# EAGLE board toyotune_3s (EAGLE 7.7.0)
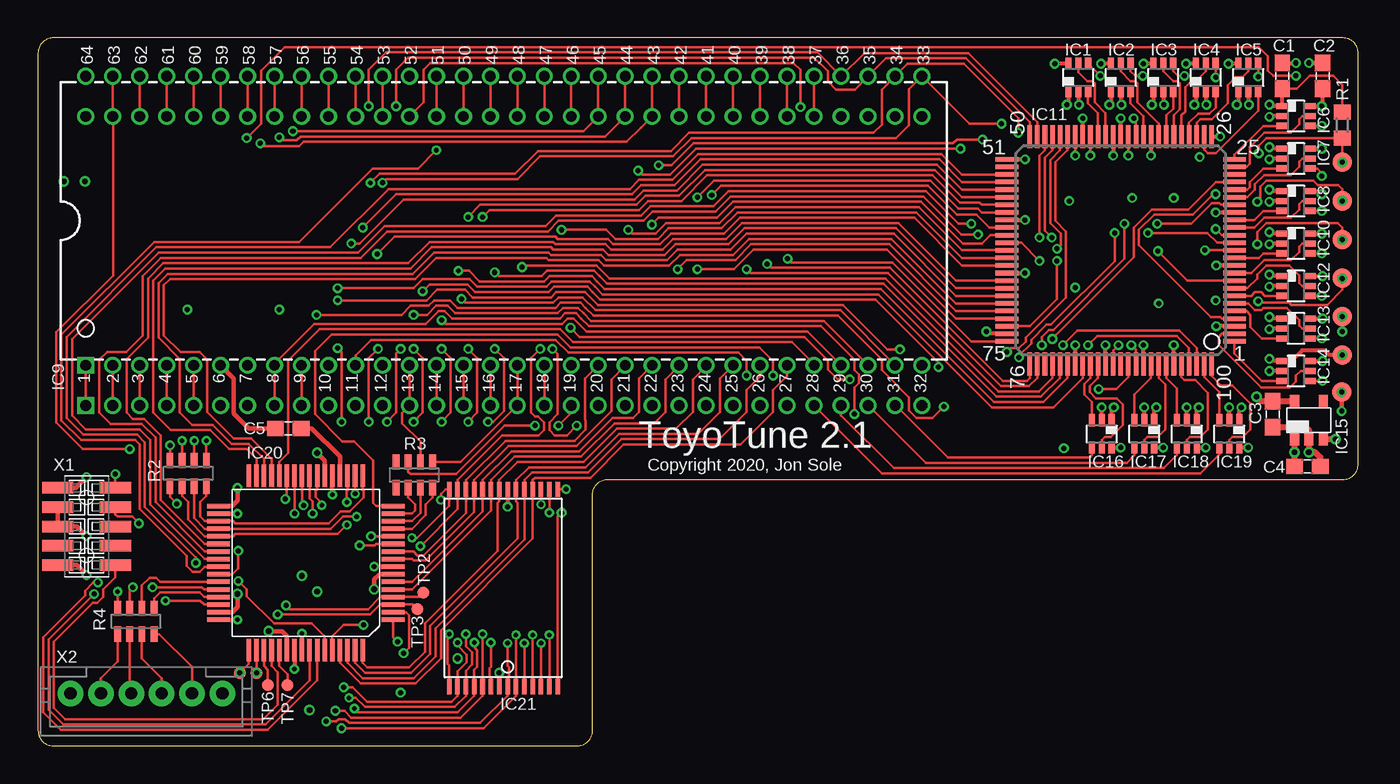
[diagram p5: board, top side]
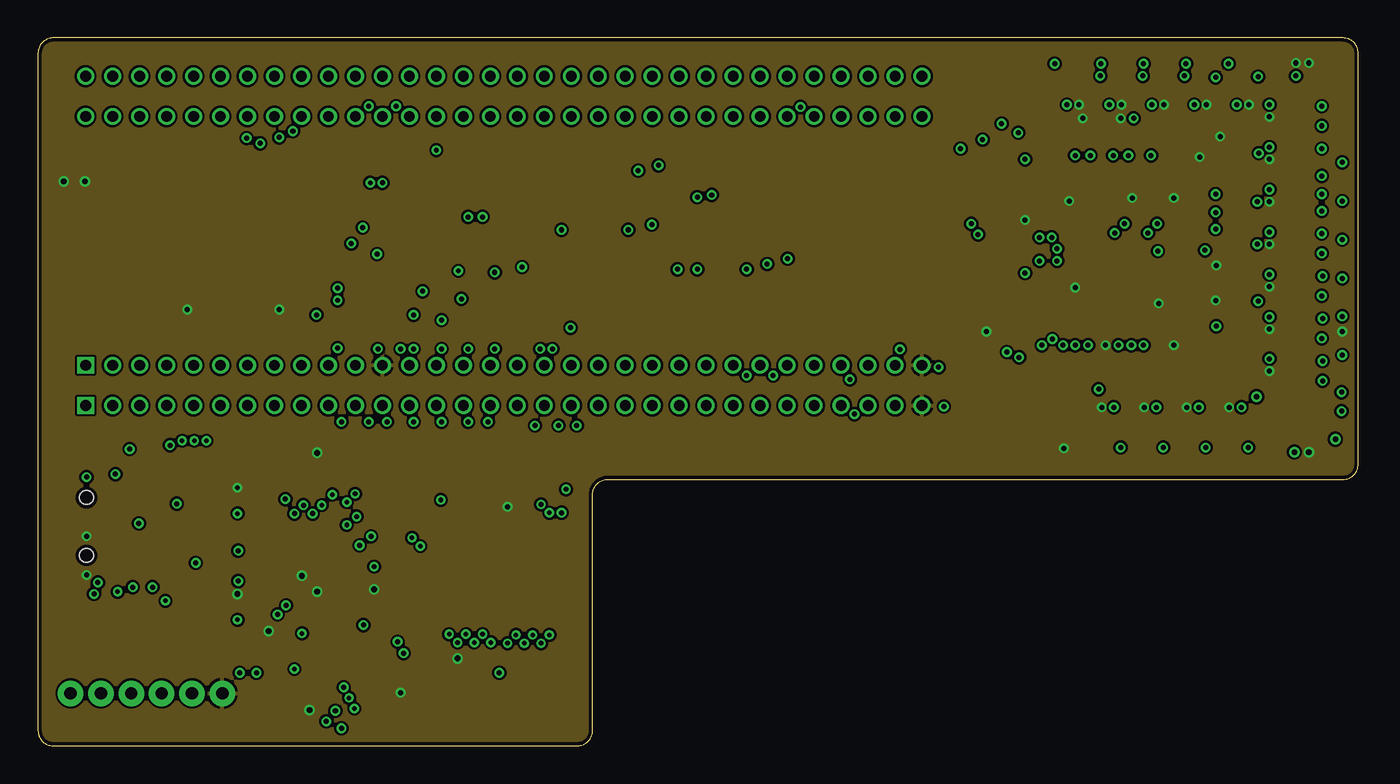
[diagram p6: board, inner layer GND]
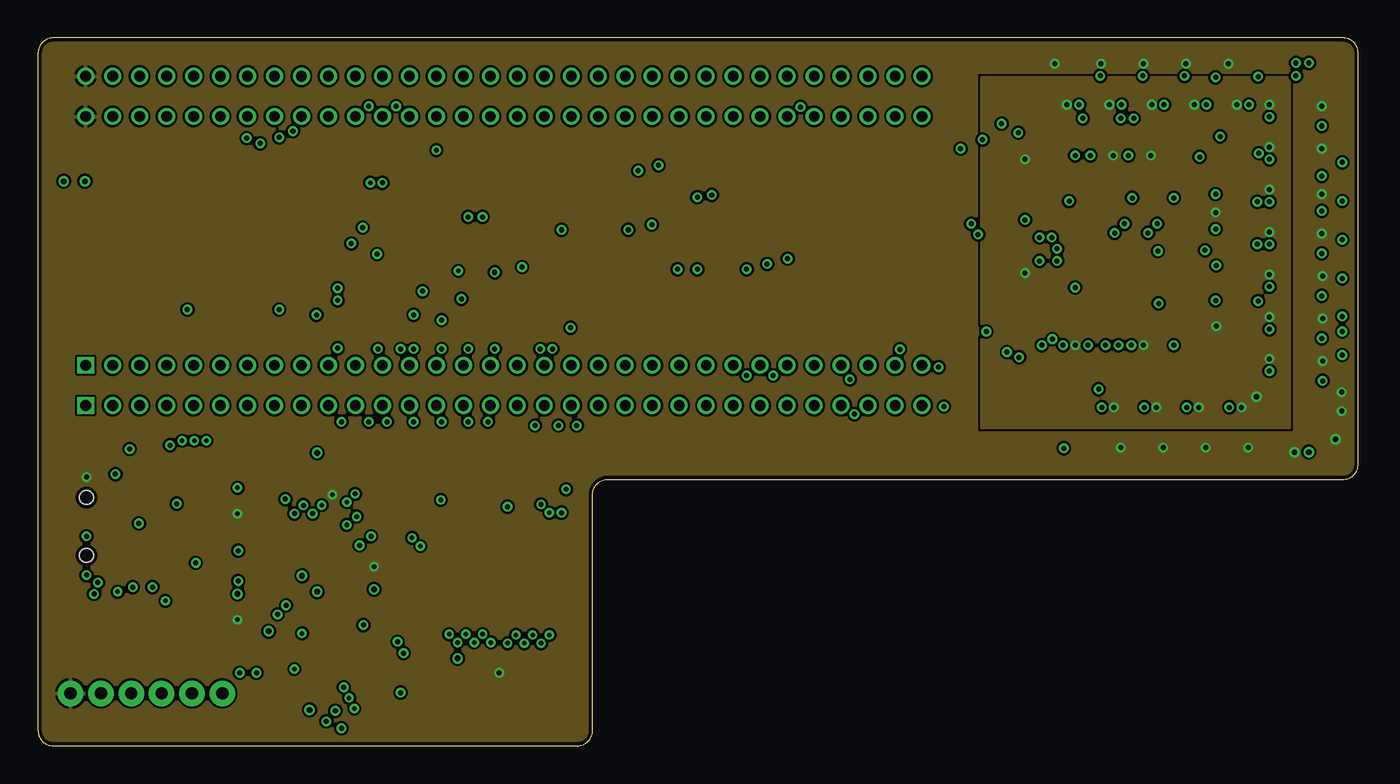
[diagram p7: board, inner layer Supply]
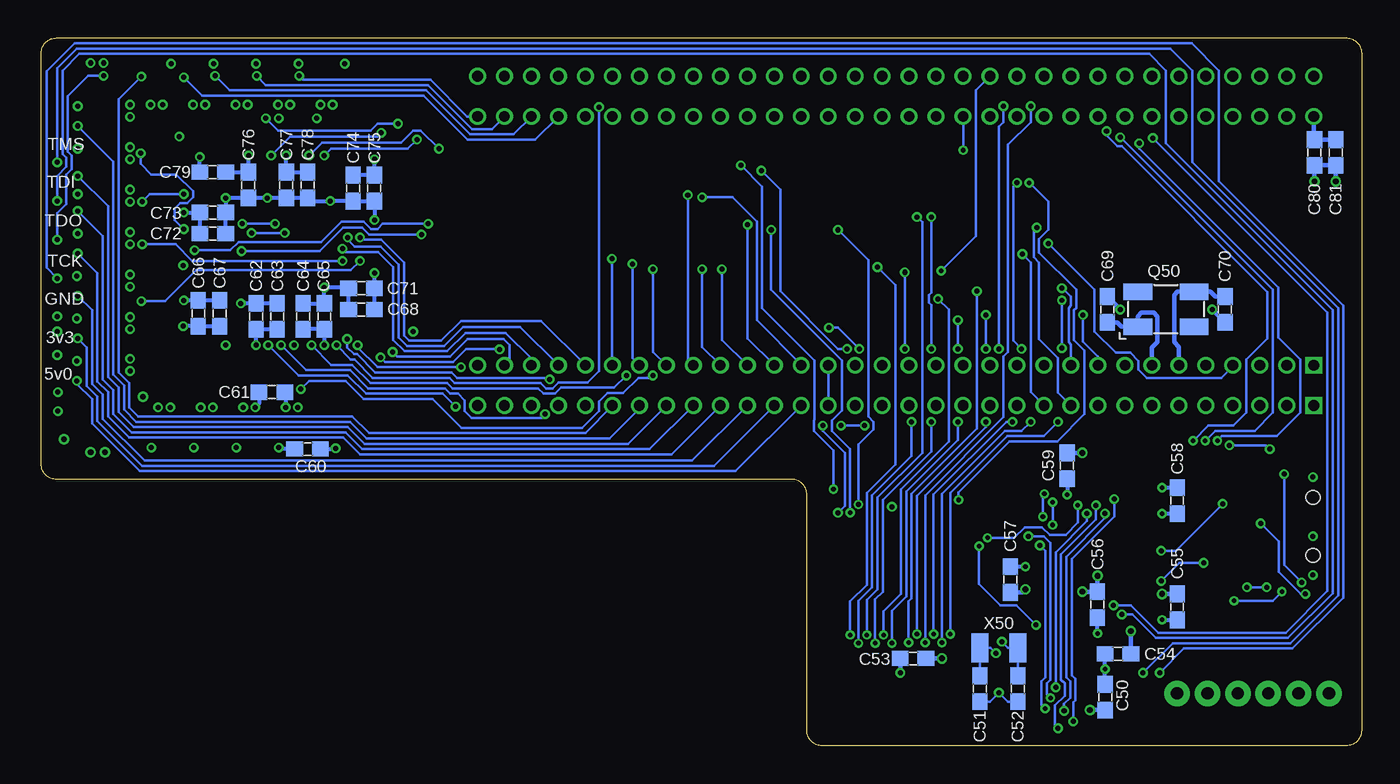
[diagram p8: board, bottom side, seen from below]

Size 87 x 46.65 mm. Coordinates in mm from the lower left corner, seen from the top.
Outline: 1.05,46.65 arc90 0,45.65 0,1 arc90 1,0 35.55,0 arc90 36.55,1 36.55,16.55 arc-90 37.55,17.55 86,17.55 arc90 87,18.55 87,45.65 arc90 86,46.65 1.05,46.65
Copper layers (1*2+15*16): Top 0.035mm / dielectric 1.5mm / GND 0.035mm / dielectric 0.15mm / Supply 0.035mm / dielectric 0.2mm / Bottom 0.035mm
Design rules "pcbway-4layer *": minimum track width 6mil, minimum drill 12mil, track to track 6mil, track to pad 6mil, pad to pad 6mil, via to via 6mil, smd to smd 0mil, copper to edge 10mil, drill to drill 10mil, minimum pad ring 8mil, minimum via ring 6mil, stop-mask expansion 2mil, vias tented up to drill 100mil, thermal gap 7mil

## Footprints (pad centres in the part's own frame; a part is rotated, then mirrored left to right if it is on the bottom)
C0603 = smd 1.1 x 1: 1 -0.85,0; 2 0.85,0
DCK_R-PDSO-G6 = smd 0.4 x 0.8: 1 -0.65,-0.9; 2 0,-0.9; 3 0.65,-0.9; 4 0.65,0.9; 5 0,0.9; 6 -0.65,0.9
SDIP-64 = drill 0.711 square: 1 -27.559,-9.525 | drill 0.711: 2 -25.781,-9.525; 3 -24.003,-9.525; 4 -22.225,-9.525; 5 -20.447,-9.525; 6 -18.669,-9.525; 7 -16.891,-9.525; 8 -15.113,-9.525; 9 -13.335,-9.525; 10 -11.557,-9.525; 11 -9.779,-9.525; 12 -8.001,-9.525; 13 -6.223,-9.525; 14 -4.445,-9.525; 15 -2.667,-9.525; 16 -0.889,-9.525; 17 0.889,-9.525; 18 2.667,-9.525; 19 4.445,-9.525; 20 6.223,-9.525; 21 8.001,-9.525; 22 9.779,-9.525; 23 11.557,-9.525; 24 13.335,-9.525; 25 15.113,-9.525; 26 16.891,-9.525; 27 18.669,-9.525; 28 20.447,-9.525; 29 22.225,-9.525; 30 24.003,-9.525; 31 25.781,-9.525; 32 27.559,-9.525; 33 27.559,9.525; 34 25.781,9.525; 35 24.003,9.525; 36 22.225,9.525; 37 20.447,9.525; 38 18.669,9.525; 39 16.891,9.525; 40 15.113,9.525; 41 13.335,9.525; 42 11.557,9.525; 43 9.779,9.525; 44 8.001,9.525; 45 6.223,9.525; 46 4.445,9.525; 47 2.667,9.525; 48 0.889,9.525; 49 -0.889,9.525; 50 -2.667,9.525; 51 -4.445,9.525; 52 -6.223,9.525; 53 -8.001,9.525; 54 -9.779,9.525; 55 -11.557,9.525; 56 -13.335,9.525; 57 -15.113,9.525; 58 -16.891,9.525; 59 -18.669,9.525; 60 -20.447,9.525; 61 -22.225,9.525; 62 -24.003,9.525; 63 -25.781,9.525; 64 -27.559,9.525
VQ100 = smd 1.5 x 0.3: 1 -7.5,6; 2 -7.5,5.5; 3 -7.5,5; 4 -7.5,4.5; 5 -7.5,4; 6 -7.5,3.5; 7 -7.5,3; 8 -7.5,2.5; 9 -7.5,2; 10 -7.5,1.5; 11 -7.5,1; 12 -7.5,0.5; 13 -7.5,0; 14 -7.5,-0.5; 15 -7.5,-1; 16 -7.5,-1.5; 17 -7.5,-2; 18 -7.5,-2.5; 19 -7.5,-3; 20 -7.5,-3.5; 21 -7.5,-4; 22 -7.5,-4.5; 23 -7.5,-5; 24 -7.5,-5.5; 25 -7.5,-6; 51 7.5,-6; 52 7.5,-5.5; 53 7.5,-5; 54 7.5,-4.5; 55 7.5,-4; 56 7.5,-3.5; 57 7.5,-3; 58 7.5,-2.5; 59 7.5,-2; 60 7.5,-1.5; 61 7.5,-1; 62 7.5,-0.5; 63 7.5,0; 64 7.5,0.5; 65 7.5,1; 66 7.5,1.5; 67 7.5,2; 68 7.5,2.5; 69 7.5,3; 70 7.5,3.5; 71 7.5,4; 72 7.5,4.5; 73 7.5,5; 74 7.5,5.5; 75 7.5,6 | smd 0.3 x 1.5: 26 -6,-7.5; 27 -5.5,-7.5; 28 -5,-7.5; 29 -4.5,-7.5; 30 -4,-7.5; 31 -3.5,-7.5; 32 -3,-7.5; 33 -2.5,-7.5; 34 -2,-7.5; 35 -1.5,-7.5; 36 -1,-7.5; 37 -0.5,-7.5; 38 0,-7.5; 39 0.5,-7.5; 40 1,-7.5; 41 1.5,-7.5; 42 2,-7.5; 43 2.5,-7.5; 44 3,-7.5; 45 3.5,-7.5; 46 4,-7.5; 47 4.5,-7.5; 48 5,-7.5; 49 5.5,-7.5; 50 6,-7.5; 76 6,7.5; 77 5.5,7.5; 78 5,7.5; 79 4.5,7.5; 80 4,7.5; 81 3.5,7.5; 82 3,7.5; 83 2.5,7.5; 84 2,7.5; 85 1.5,7.5; 86 1,7.5; 87 0.5,7.5; 88 0,7.5; 89 -0.5,7.5; 90 -1,7.5; 91 -1.5,7.5; 92 -2,7.5; 93 -2.5,7.5; 94 -3,7.5; 95 -3.5,7.5; 96 -4,7.5; 97 -4.5,7.5; 98 -5,7.5; 99 -5.5,7.5; 100 -6,7.5
DDC_R-PDSO-G5 = smd 0.6 x 0.8: 1 -0.95,-1.25; 2 0,-1.25; 3 0.95,-1.25; 4 0.95,1.25; 5 -0.95,1.25
TQFP64-05 = smd 1.5 x 0.3: 1 -5.75,3.75; 2 -5.75,3.25; 3 -5.75,2.75; 4 -5.75,2.25; 5 -5.75,1.75; 6 -5.75,1.25; 7 -5.75,0.75; 8 -5.75,0.25; 9 -5.75,-0.25; 10 -5.75,-0.75; 11 -5.75,-1.25; 12 -5.75,-1.75; 13 -5.75,-2.25; 14 -5.75,-2.75; 15 -5.75,-3.25; 16 -5.75,-3.75; 33 5.75,-3.75; 34 5.75,-3.25; 35 5.75,-2.75; 36 5.75,-2.25; 37 5.75,-1.75; 38 5.75,-1.25; 39 5.75,-0.75; 40 5.75,-0.25; 41 5.75,0.25; 42 5.75,0.75; 43 5.75,1.25; 44 5.75,1.75; 45 5.75,2.25; 46 5.75,2.75; 47 5.75,3.25; 48 5.75,3.75 | smd 0.3 x 1.5: 17 -3.75,-5.75; 18 -3.25,-5.75; 19 -2.75,-5.75; 20 -2.25,-5.75; 21 -1.75,-5.75; 22 -1.25,-5.75; 23 -0.75,-5.75; 24 -0.25,-5.75; 25 0.25,-5.75; 26 0.75,-5.75; 27 1.25,-5.75; 28 1.75,-5.75; 29 2.25,-5.75; 30 2.75,-5.75; 31 3.25,-5.75; 32 3.75,-5.75; 49 3.75,5.75; 50 3.25,5.75; 51 2.75,5.75; 52 2.25,5.75; 53 1.75,5.75; 54 1.25,5.75; 55 0.75,5.75; 56 0.25,5.75; 57 -0.25,5.75; 58 -0.75,5.75; 59 -1.25,5.75; 60 -1.75,5.75; 61 -2.25,5.75; 62 -2.75,5.75; 63 -3.25,5.75; 64 -3.75,5.75
TSOP28 = smd 1 x 0.3: 1 -6.5,-0.35; 2 -6.5,-0.9; 3 -6.5,-1.45; 4 -6.5,-2; 5 -6.5,-2.55; 6 -6.5,-3.1; 7 -6.5,-3.65; 8 6.5,-3.65; 9 6.5,-3.1; 10 6.5,-2.55; 11 6.5,-2; 12 6.5,-1.45; 13 6.5,-0.9; 14 6.5,-0.35; 15 6.5,0.2; 16 6.5,0.75; 17 6.5,1.3; 18 6.5,1.85; 19 6.5,2.4; 20 6.5,2.95; 21 6.5,3.5; 22 -6.5,3.5; 23 -6.5,2.95; 24 -6.5,2.4; 25 -6.5,1.85; 26 -6.5,1.3; 27 -6.5,0.75; 28 -6.5,0.2
1X06_SMD = smd 1.27 x 1.27: GND 3.81,0; TCK 1.27,0; TDI -3.81,0; TDO -1.27,0; TMS -6.35,0; VCC 6.35,0
CRYSTAL-SMD-5X3 = smd 1.9 x 1.1: 1 -1.85,-1.15; 2 1.85,-1.15; 3 1.85,1.15; 4 -1.85,1.15
R0603 = smd 1 x 1.1: 1 -0.85,0; 2 0.85,0
CAT16-J4 = smd 0.45 x 1: 1 -1.2,-0.8; 2 -0.4,-0.8; 3 0.4,-0.8; 4 1.2,-0.8; 5 1.2,0.9; 6 0.4,0.9; 7 -0.4,0.9; 8 -1.2,0.9
TP13R = smd 1.3 x 1.3: TP 0,0
TP08R = smd 0.8 x 0.8: TP 0,0
SDIP-64-CONN = drill 0.711 square: 1 -27.559,-9.525 | drill 0.711: 2 -25.781,-9.525; 3 -24.003,-9.525; 4 -22.225,-9.525; 5 -20.447,-9.525; 6 -18.669,-9.525; 7 -16.891,-9.525; 8 -15.113,-9.525; 9 -13.335,-9.525; 10 -11.557,-9.525; 11 -9.779,-9.525; 12 -8.001,-9.525; 13 -6.223,-9.525; 14 -4.445,-9.525; 15 -2.667,-9.525; 16 -0.889,-9.525; 17 0.889,-9.525; 18 2.667,-9.525; 19 4.445,-9.525; 20 6.223,-9.525; 21 8.001,-9.525; 22 9.779,-9.525; 23 11.557,-9.525; 24 13.335,-9.525; 25 15.113,-9.525; 26 16.891,-9.525; 27 18.669,-9.525; 28 20.447,-9.525; 29 22.225,-9.525; 30 24.003,-9.525; 31 25.781,-9.525; 32 27.559,-9.525; 33 27.559,9.525; 34 25.781,9.525; 35 24.003,9.525; 36 22.225,9.525; 37 20.447,9.525; 38 18.669,9.525; 39 16.891,9.525; 40 15.113,9.525; 41 13.335,9.525; 42 11.557,9.525; 43 9.779,9.525; 44 8.001,9.525; 45 6.223,9.525; 46 4.445,9.525; 47 2.667,9.525; 48 0.889,9.525; 49 -0.889,9.525; 50 -2.667,9.525; 51 -4.445,9.525; 52 -6.223,9.525; 53 -8.001,9.525; 54 -9.779,9.525; 55 -11.557,9.525; 56 -13.335,9.525; 57 -15.113,9.525; 58 -16.891,9.525; 59 -18.669,9.525; 60 -20.447,9.525; 61 -22.225,9.525; 62 -24.003,9.525; 63 -25.781,9.525; 64 -27.559,9.525
1296-10 = smd 0.76 x 2.05: 1 -2.54,-1.907; 2 -2.54,1.907; 3 -1.27,-1.907; 4 -1.27,1.907; 5 0,-1.907; 6 0,1.907; 7 1.27,-1.907; 8 1.27,1.907; 9 2.54,-1.907; 10 2.54,1.907 | hole 0.9: -1.905,0; 1.905,0
JST-PH6 = drill 0.813 pad 1.676: 1 5,0; 2 3,0; 3 1,0; 4 -1,0; 5 -3,0; 6 -5,0
3.2X1.5-2-PAD = smd 1.1 x 1.9: 1 -1.25,0; 2 1.25,0

## Placement (x,y rotation side)
C1  0.1uF  [C0603]  82,44.15 270 top
C2  0.1uF  [C0603]  84.65,44.15 270 top
C3  1uF  [C0603]  81.35,21.85 270 top
C4  1uF  [C0603]  83.65,18.4 0 top
C5  10pF  [C0603]  16.5,20.9 0 top
C50  1uF  [C0603]  16.9,3.2 270 bottom
C51  DNF  [C0603]  25.15,3.75 90 bottom
C52  DNF  [C0603]  22.65,3.75 90 bottom
C53  0.1uF  [C0603]  29.55,5.75 180 bottom
C54  100nF  [C0603]  16.05,6.05 0 bottom
C55  100nF  [C0603]  12.15,9.15 90 bottom
C56  100nF  [C0603]  17.4,9.3 90 bottom
C57  100nF  [C0603]  23.15,10.95 270 bottom
C58  100nF  [C0603]  12.15,16.15 90 bottom
C59  100nF  [C0603]  19.4,18.45 90 bottom
C60  0.1uF  [C0603]  69.45,19.55 180 bottom
C61  0.1uF  [C0603]  71.8,23.3 0 bottom
C62  0.01uF  [C0603]  72.85,28.3 270 bottom
C63  0.1uF  [C0603]  71.45,28.3 270 bottom
C64  0.1uF  [C0603]  69.75,28.3 270 bottom
C65  0.01uF  [C0603]  68.35,28.3 270 bottom
C66  0.01uF  [C0603]  76.65,28.5 270 bottom
C67  0.1uF  [C0603]  75.25,28.5 270 bottom
C68  0.1uF  [C0603]  65.9,28.75 0 bottom
C69  10pF  [C0603]  16.75,28.75 90 bottom
C70  10pF  [C0603]  9,28.75 90 bottom
C71  0.01uF  [C0603]  65.9,30.15 0 bottom
C72  0.1uF  [C0603]  75.7,33.75 180 bottom
C73  0.01uF  [C0603]  75.7,35.15 180 bottom
C74  0.1uF  [C0603]  66.45,36.75 90 bottom
C75  0.01uF  [C0603]  65.05,36.75 90 bottom
C76  0.01uF  [C0603]  73.35,36.95 90 bottom
C77  0.01uF  [C0603]  70.85,36.95 90 bottom
C78  0.1uF  [C0603]  69.45,36.95 90 bottom
C79  0.1uF  [C0603]  75.7,37.8 0 bottom
C80  0.01uF  [C0603]  3.1,39.1 90 bottom
C81  0.1uF  [C0603]  1.7,39.1 90 bottom
DRILEGEND  [DRILEGEND]  -6.23,-12.64 0 top  (outside the outline)
IC1  SN74LVC1T45DCK  [DCK_R-PDSO-G6]  68.55,44.05 0 top
IC2  SN74LVC1T45DCK  [DCK_R-PDSO-G6]  71.35,44.05 0 top
IC3  SN74LVC1T45DCK  [DCK_R-PDSO-G6]  74.15,44.05 0 top
IC4  SN74LVC1T45DCK  [DCK_R-PDSO-G6]  76.95,44.05 0 top
IC5  SN74LVC1T45DCK  [DCK_R-PDSO-G6]  79.75,44.05 0 top
IC6  SN74LVC1T45DCK  [DCK_R-PDSO-G6]  82.9,41.5 270 top
IC7  SN74LVC1T45DCK  [DCK_R-PDSO-G6]  82.9,38.7 270 top
IC8  SN74LVC1T45DCK  [DCK_R-PDSO-G6]  82.9,35.9 270 top
IC9  D15180X-XXXX  [SDIP-64]  30.7,34.6 0 top
IC10  SN74LVC1T45DCK  [DCK_R-PDSO-G6]  82.9,33.1 270 top
IC11  XCR3128XL  [VQ100]  71.35,32.65 180 top
IC12  SN74LVC1T45DCK  [DCK_R-PDSO-G6]  82.9,30.3 270 top
IC13  SN74LVC1T45DCK  [DCK_R-PDSO-G6]  82.9,27.5 270 top
IC14  SN74LVC1T45  [DCK_R-PDSO-G6]  82.9,24.7 270 top
IC15  TLV70033  [DDC_R-PDSO-G5]  83.75,21.45 0 top
IC16  SN74LVC1T45DCK  [DCK_R-PDSO-G6]  70.1,20.55 180 top
IC17  SN74LVC1T45DCK  [DCK_R-PDSO-G6]  72.9,20.55 180 top
IC18  SN74LVC1T45DCK  [DCK_R-PDSO-G6]  75.7,20.55 180 top
IC19  SN74LVC1T45DCK  [DCK_R-PDSO-G6]  78.5,20.55 180 top
IC20  ATSAMC21JE18A-AU  [TQFP64-05]  17.65,12.05 180 top
IC21  IS62C256AL  [TSOP28]  30.6,10.4 90 top
JP1  JTAG  [1X06_SMD]  85.95,32.1 270 top
Q50  16Mhz  [CRYSTAL-SMD-5X3]  12.89,28.77 0 bottom
R1  10K  [R0603]  85.95,40.9 90 top
R2  22R  [CAT16-J4]  9.9,18 180 top
R3  22R  [CAT16-J4]  24.8,17.9 180 top
R4  22R  [CAT16-J4]  6.45,8.25 180 top
TP1  TPTP13R  [TP13R]  85.9,23.3 0 top
TP2  TPTP08R  [TP08R]  25.4,10.1 0 top
TP3  TPTP08R  [TP08R]  25,9 0 top
TP4  TPTP08R  [TP08R]  13.3,4.8 0 top
TP5  TPTP08R  [TP08R]  14.4,4.8 0 top
TP6  TPTP08R  [TP08R]  15.15,4 0 top
TP7  TPTP08R  [TP08R]  16.45,4 0 top
U1  D151803-CONN  [SDIP-64-CONN]  30.7,31.95 0 top
X1  1296-T10  [1296-10]  3.2,14.45 270 top
X2  [JST-PH6]  7.15,3.45 180 top
X50  32.768KHz  [3.2X1.5-2-PAD]  23.9,6.45 180 bottom

## Tracks (layer width: path | path; a pad name or v marks a point on that pad's centre or on a via)
!A_INT  (via drill 0.3)
  Top 0.178: R4.4 v5.25,10.15 | v8.4,9.55 10.7,9.55 10.95,9.3 IC20.46
  Bottom 0.178: v5.25,10.15 5.85,9.55 v8.4,9.55
!D_HALT  (via drill 0.3)
  Top 0.178: U1.51 IC9.51 | IC20.41 11,11.8 10.65,11.45 10.2,11.45 9.8,11.85 9.8,12.5 6.7,15.6 6.7,19.85 6.4,20.15 2.85,20.15 1.55,21.45 1.55,27.1 7.65,33.2 17.2,33.2 22.05,38.05 25.05,38.05 v26.25,39.25
  Bottom 0.178: U1.51 v26.25,39.25
!D_INIT  (via drill 0.3)
  Top 0.178: IC11.81 67.85,24.25 66.25,22.65 63,22.65 55.55,30.1 37.35,30.1 36.85,30.6 36.5,30.95 33.7,30.95 33.35,30.6 29.1,30.6 28.4,31.3 v27.7,31.3
  Bottom 0.178: v27.7,31.3 25.4,33.6 25.4,43.2 IC9.52
!D_IRL
  Top 0.178: U1.5 IC9.5
!D_IRP  (via drill 0.33)
  Top 0.178: U1.4 IC9.4 | IC11.55 60.9,36.65 59.25,38.3 43.8,38.3 42.1,36.6 39.9,36.6 39.3,36 24.1,36 21.2,33.1 v20.65,33.1
  Bottom 0.178: IC9.4 8.48,25.02 9.25,24.25 14.15,24.25 14.7,24.8 14.7,25.35 15.25,25.9 16.2,25.9 17.6,27.3 17.6,30.05 v20.65,33.1
!D_NMI
  Top 0.178: U1.3 IC9.3
!D_RD  (via drill 0.33)
  Top 0.178: IC11.83 68.85,24.25 66.9,22.3 62.85,22.3 55.4,29.75 37.2,29.75 36.7,30.25 36.35,30.6 33.85,30.6 33.5,30.25 28.95,30.25 28.45,30.75 25.35,30.75 24.75,30.15 v19.75,30.15
  Bottom 0.178: IC9.10 19.15,26.45 19.3,26.6 19.3,28.85 19.15,29 19.15,29.6 19.7,30.15 v19.75,30.15
!D_TEST
  Top 0.178: U1.49 IC9.49
!D_WDC
  Top 0.178: U1.53 IC9.53
!D_WI
  Top 0.178: U1.50 IC9.50
!D_WR  (via drill 0.33)
  Top 0.178: v46.7,24.4 46.7,25.35 46.15,25.9 34.95,25.9 34.1,26.75 21.95,26.75 20.93,25.73 IC9.11 | IC11.89 71.85,24.3 71.05,23.5 v69.9,23.5
  Bottom 0.178: v46.7,24.4 46.85,24.25 47.65,24.25 48.65,23.25 49.7,23.25 50.25,22.7 50.25,22.05 51.35,20.95 59.3,20.95 61.2,22.85 65.75,22.85 66.95,24.05 69.35,24.05 v69.9,23.5
!E_INIT  (via drill 0.33)
  Top 0.178: IC11.98 76.35,26.2 75.2,27.35 68.5,27.35 v67.55,26.4 | U1.52 25.4,42.4 25.4,44.55 25.85,45 49.8,45 50.25,44.55 v50.25,42.1
  Bottom 0.178: v67.55,26.4 66.6,25.45 66.35,25.45 65.15,24.25 60.1,24.25 59.75,23.9 54.1,23.9 53.75,23.55 53.3,23.55 52.9,23.95 51,23.95 50.25,24.7 v50.25,42.1
!E_IS  (via drill 0.33)
  Top 0.178: IC11.54 60.9,37.15 59.4,38.65 43.65,38.65 41.95,36.95 39.75,36.95 39.15,36.35 23.6,36.35 v21.4,34.15
  Bottom 0.178: U1.10 20,23.28 20,25.55 21.25,26.8 21.25,31.85 21.6,32.2 21.6,33.95 v21.4,34.15
!E_OS  (via drill 0.33)
  Top 0.178: IC11.65 60.9,31.65 57.75,34.8 46.25,34.8 45.2,33.75 41.7,33.75 41,33.05 37.9,33.05 37.55,33.4 34.25,33.4 34.1,33.55 23.5,33.55 v22.35,32.4
  Bottom 0.178: U1.11 21.8,23.3 21.8,31.85 v22.35,32.4
!M_RAM_CS  (via drill 0.3, 0.33)
  Top 0.178: v35.1,27.55 35.7,26.95 50.5,26.95 52.05,25.4 52.05,24.8 52.7,24.15 v53.5,24.15 | v66.85,26.8 66.85,26.85 72.2,32.2 72.2,34.15 73.4,35.35 75.8,35.35 77.6,37.15 IC11.22 | v33.1,26.15 32.5,25.55 32.5,21.95 32.75,21.7 32.95,21.7 33.35,21.3 33.35,20.8 33,20.45 30.6,20.45 27.65,17.5 IC21.20 27.65,15.6 v25.2,13.15 | IC20.60 19.4,7.2 20.15,7.95 v21.45,7.95
  Bottom 0.178: v53.5,24.15 53.6,24.25 59.6,24.25 59.95,24.6 65,24.6 66.2,25.8 66.4,25.8 66.85,26.25 v66.85,26.8 | v35.1,27.55 34.5,27.55 v33.1,26.15 | v25.2,13.15 25.2,10.65 23.8,9.25 22.75,9.25 v21.45,7.95
!M_RD  (via drill 0.3, 0.33)
  Top 0.178: IC11.14 77.7,33.15 77.05,33.8 v73.15,33.8 | v56.8,26.12 55.98,26.12 53.05,29.05 36.9,29.05 36.05,29.9 34.15,29.9 33.8,29.55 28.65,29.55 28.15,30.05 26.3,30.05 25.6,29.35 v19.75,29.35 | v64.65,25.6 64.65,25.7 65.45,26.5 65.45,26.75 66.45,27.75 66.75,27.75 70.95,31.95 v70.95,33.8 | IC21.22 27.1,5.3 27,5.4 27,7.25 v27.1,7.35 | v20,21.35 20,25.95 v19.75,26.2
  Bottom 0.178: v56.8,26.12 56.78,26.15 59,26.15 59.85,25.3 64.35,25.3 v64.65,25.6 | v70.95,33.8 v73.15,33.8 | v20,21.35 20.95,20.4 23.35,20.4 27.1,16.65 v27.1,7.35 | v19.75,26.2 v19.75,29.35
!M_WR  (via drill 0.3, 0.33)
  Top 0.178: IC11.19 77.95,35.65 77.85,35.75 77.35,35.75 76,34.4 v73.75,34.4 | v59.35,24.95 59.35,25.25 55.2,29.4 37.05,29.4 36.55,29.9 36.2,30.25 34,30.25 33.65,29.9 28.8,29.9 28.3,30.4 25.8,30.4 v25.35,29.95 | v66.15,26.4 66.15,26.95 66.6,27.4 66.9,27.4 71.6,32.1 v71.6,34.4 | IC21.27 29.85,4.5 29.75,4.6 29.75,5.1 29.85,5.2 v29.85,6.8
  Bottom 0.178: v71.6,34.4 v73.75,34.4 | v66.15,26.4 66.15,26.25 64.85,24.95 v59.35,24.95 | v25.35,29.95 25.35,20.9 29.65,16.6 29.65,9.7 29.85,9.5 v29.85,6.8
!RESET
  Top 0.178: IC20.52 15.4,5.25 15.8,4.85 15.8,2.7 14.85,1.75 1.8,1.75 1.05,2.5 1.05,6.85 3.6,9.4 3.9,9.4 4.3,9.8 4.3,10.3 5.1,11.1 X1.10
!X_INIT  (via drill 0.33)
  Top 0.178: IC11.97 75.85,26.2 75.05,27 69.8,27 v69.2,26.4 | v48.45,24.4 48.45,25.35 47.55,26.25 35.1,26.25 34.25,27.1 19.35,27.1 18.25,26 18.25,21.85 20.05,20.05 20.85,20.05 22.1,18.8 22.1,16 22.3,15.8 IC20.16
  Bottom 0.178: v69.2,26.4 67.9,25.1 66.5,25.1 65.3,23.9 60.25,23.9 59.9,23.55 54.25,23.55 53.9,23.2 53.15,23.2 52.75,23.6 49.25,23.6 v48.45,24.4
!X_INT
  Top 0.178: R4.5 5.25,5.55 4.15,4.45 X2.2
!X_RD  (via drill 0.33)
  Top 0.178: v61.95,33.7 60.85,33.7 58.35,36.2 45.65,36.2 44.65,35.2 40.5,35.2 39.9,34.6 34.3,34.6 33.6,33.9 23,33.9 21.25,32.15 8.1,32.15 6.9,30.95 6.9,27.05 5.8,25.95 4.55,25.95 4.05,25.45 4.05,21.95 4.8,21.2 6.85,21.2 7.75,20.3 7.75,16.05 11,12.8 IC20.39 | IC11.9 75.75,30.65 v73.8,32.6
  Bottom 0.178: v73.8,32.6 68.65,32.6 67.1,34.15 65.85,34.15 65.4,33.7 v61.95,33.7
!X_WR  (via drill 0.33)
  Top 0.178: v61.5,34.4 60.65,34.4 58.5,36.55 45.5,36.55 44.5,35.55 40.35,35.55 39.75,34.95 34.15,34.95 33.45,34.25 22.85,34.25 21.1,32.5 7.95,32.5 2.25,26.8 2.25,21.75 3.15,20.85 6.7,20.85 7.4,20.15 7.4,15.9 11,12.3 IC20.40 | v76.9,32.65 IC11.13
  Bottom 0.178: v76.9,32.65 74.55,32.65 74,33.2 68.55,33.2 67.2,34.55 65.75,34.55 65.25,34.05 64.85,34.05 64.5,34.4 v61.5,34.4
C_DRA0
  Top 0.178: IC11.30 75.35,41.55 75.6,41.8 75.6,43.4 76,43.8 76.3,43.8 76.95,44.45 IC4.5
C_DRA1
  Top 0.178: IC3.5 74.15,44.45 74.8,43.8 75.1,43.8 75.25,43.65 75.25,41.95 74.85,41.55 IC11.31
C_DRA2
  Top 0.178: IC2.5 71.35,44.45 72,43.8 72.3,43.8 72.45,43.65 72.45,42.4 73.85,41 IC11.33
C_DRA3
  Top 0.178: IC11.40 70.35,41.7 69.65,42.4 69.65,43.65 69.5,43.8 69.15,43.8 68.55,44.4 IC1.5
C_DRA4
  Top 0.178: IC16.5 70.1,20.15 70.3,20.35 70.7,20.35 71.5,21.15 71.5,22.5 71.1,22.9 69.7,22.9 69.3,23.3 69.3,23.7 69.85,24.25 IC11.85
C_DRA5
  Top 0.178: IC17.5 72.9,20.15 73.1,20.35 73.8,20.35 74.3,20.85 74.3,23.8 73.85,24.25 IC11.93
C_DRA6
  Top 0.178: IC18.5 75.7,20.15 75.9,20.35 76.6,20.35 77.1,20.85 77.1,23.25 76.25,24.1 75.55,24.1 75.35,24.3 IC11.96
C_DRA7
  Top 0.178: IC19.5 78.5,20.15 78.7,20.35 79.4,20.35 79.9,20.85 79.9,22.55 78.7,23.75 77.95,23.75 77.35,24.35 IC11.100
C_DRB0
  Top 0.178: IC11.28 76.35,41.05 76.6,41.3 77.35,41.3 78.4,42.35 78.4,43.55 78.9,44.05 79.35,44.05 79.75,44.45 IC5.5
C_DRB1
  Top 0.178: IC11.24 79.65,38.15 79.85,38.35 79.85,39.45 80.8,40.4 82.55,40.4 83.1,40.95 83.1,41.3 83.3,41.5 IC6.5
C_DRB2
  Top 0.178: IC11.20 79.7,36.15 80.2,36.65 80.2,37 80.8,37.6 82.55,37.6 83.1,38.15 83.1,38.5 83.3,38.7 IC7.5
C_DRB3
  Top 0.178: IC11.16 80.15,34.15 80.8,34.8 82.55,34.8 83.1,35.35 83.1,35.7 83.3,35.9 IC8.5
C_DRB4
  Top 0.178: IC11.10 79.95,31.15 80.8,32 82.55,32 83.1,32.55 83.1,32.9 83.3,33.1 IC10.5
C_DRB5
  Top 0.178: IC11.8 79.7,30.15 80.35,30.8 80.35,31.05 80.95,31.65 82.45,31.65 83.1,31 83.1,30.5 83.3,30.3 IC12.5
C_DRB6
  Top 0.178: IC11.6 79.75,29.15 80.2,28.7 80.6,28.7 80.75,28.85 82.3,28.85 83.1,28.05 83.1,27.7 83.3,27.5 IC13.5
C_DRB7
  Top 0.178: IC14.5 83.2,24.7 82.9,24.4 82.9,24 82.5,23.6 80.6,23.6 77.8,26.4 77.8,26.95 78,27.15 IC11.2
C_PA0
  Top 0.178: IC4.3 77.6,42.05 77.2,41.65 76.45,41.65 75.85,41.05 IC11.29
C_PA1
  Top 0.178: IC11.32 74.35,41.55 74.8,42 IC3.3
C_PA2
  Top 0.178: IC11.35 72.85,41.5 72,42.35 IC2.3
C_PA3
  Top 0.178: IC1.3 69.2,42.35 69.85,41.7 IC11.41
C_PA4
  Top 0.178: IC16.3 69.45,22.65 68.95,23.15 68.95,23.85 69.35,24.25 IC11.84
C_PA5
  Top 0.178: 73.35,25.35 IC11.92 73.35,24.25 72.25,23.15 IC17.3
C_PA6
  Top 0.178: 74.35,25.3 IC11.94 74.35,24.25 75.05,23.55 IC18.3
C_PA7
  Top 0.178: IC11.99 76.85,24.3 77.85,23.3 IC19.3
C_PB0
  Top 0.178: IC11.27 76.85,39.3 77.1,39.05 77.6,39.05 80.4,41.85 IC5.3
C_PB1
  Top 0.178: IC6.3 80.75,40.85 78.85,38.95 IC11.25
C_PB2
  Top 0.178: IC7.3 80.75,38.05 79.85,37.15 79.85,36.8 79.7,36.65 IC11.21
C_PB3
  Top 0.178: IC11.17 80.15,34.65 80.75,35.25 IC8.3
C_PB4
  Top 0.178: IC10.3 80.75,32.45 80.45,32.15 IC11.12
C_PB5
  Top 0.178: IC11.7 79.95,29.65 80.2,29.9 80.6,29.9 80.85,29.65 IC12.3
C_PB6
  Top 0.178: IC13.3 80.65,26.85 79.9,27.6 79.9,28.4 79.65,28.65 IC11.5
C_PB7
  Top 0.178: IC14.3 80.65,24.05 78.85,25.85 IC11.1
D1_XIN
  Top 0.305: IC9.6 12.9,24.21 12.9,21.9 13.9,20.9 C5.1
  Bottom 0.305: IC9.6 12.03,26.28 12.35,26.6 12.35,29.7 12.13,29.92 Q50.3 9.97,29.92 9.65,29.6 C70.2
D1_XOUT
  Bottom 0.305: IC9.7 13.81,26.24 13.45,26.6 13.45,28.3 13.7,28.55 14.5,28.55 14.75,28.3 Q50.1 15.82,27.62 16.1,27.9 C69.1
D_A8  (via drill 0.3, 0.33)
  Top 0.178: IC11.49 65.85,41.1 61.3,45.65 54.45,45.65 IC9.36 51.35,45.7 22.95,45.7 21.8,44.55 v21.8,42.15 | v28.75,6.8 28.75,6.5 28.95,6.3 28.95,5.2 28.75,5 IC21.25 28.75,3.3 27.65,2.2 21.1,2.2 v20.85,2.45 | IC20.11 22.3,13.3 22.2,13.2 v21.2,13.2
  Bottom 0.178: v21.2,13.2 20.85,12.85 20.85,4.5 21.1,4.25 21.1,2.7 v20.85,2.45 | v21.8,42.15 21.8,41.1 23.3,39.6 23.3,25.95 23.6,25.65 23.6,21.65 28.75,16.5 v28.75,6.8
D_A9  (via drill 0.3, 0.33)
  Top 0.178: IC11.50 65.35,41.1 61.15,45.3 55.88,45.3 IC9.35 53.83,43.25 52.6,43.25 52.05,43.8 52.05,44.45 51.15,45.35 24.4,45.35 23.6,44.55 v23.6,42.15 | v28.2,7.35 28.2,6.55 28.6,6.15 28.6,5.35 28.2,4.95 IC21.24 28.2,3.3 27.45,2.55 21.55,2.55 20.95,3.15 v20.5,3.15 | v23,21.35 23.6,21.95 23.6,25.85 v23.9,26.15 | IC20.12 v21.95,13.8
  Bottom 0.178: v23,21.35 23.4,21.35 28.2,16.55 v28.2,7.35 | v23.9,26.15 23.9,40.8 23.6,41.1 v23.6,42.15 | v21.95,13.8 20.95,13.8 20.5,13.35 20.5,4.35 20.75,4.1 20.75,3.4 v20.5,3.15
D_A10  (via drill 0.3, 0.33)
  Top 0.178: v71.85,38.9 IC11.37 | v64.6,40.4 64.6,41.35 61,44.95 57.31,44.95 IC9.34 55.6,43.24 55.6,40.94 55.06,40.4 42.9,40.4 41.7,39.2 32.95,39.2 31.45,37.7 22.5,37.7 v21.9,37.1 | IC20.23 18.4,16.9 18.3,16.8 18.3,16.4 18.7,16 v18.7,15.85 | v24.65,13.7 25,13.7 27.1,15.8 IC21.21 26.85,16.9 26.55,16.6 v26.55,16.2
  Bottom 0.178: v64.6,40.4 64.85,40.15 70.6,40.15 v71.85,38.9 | v24.65,13.7 22.9,13.7 22.2,14.4 21.05,14.4 20.55,13.9 19.5,13.9 18.7,14.7 v18.7,15.85 | v21.9,37.1 20.65,35.85 20.65,34 21.25,33.4 21.25,32.5 18.8,30.05 18.8,28.85 18.95,28.7 18.95,26.75 18.25,26.05 18.25,21.85 20.05,20.05 23.2,20.05 26.55,16.7 v26.55,16.2
D_A11  (via drill 0.3, 0.33)
  Top 0.178: v63.5,41 61.38,41 IC9.33 57.4,43.27 57.4,40.9 56.55,40.05 43.05,40.05 41.85,38.85 33.1,38.85 31.6,37.35 22.95,37.35 v22.7,37.1 | IC11.36 72.35,41.2 v72.2,41.35 | v27.65,6.8 27.65,6.6 28.25,6 28.25,5.5 27.65,4.9 IC21.23 27.65,3.3 27.25,2.9 21.7,2.9 20.75,3.85 v20.15,3.85 | v21.8,21.35 21.8,25.55 v22.4,26.15 | IC20.24 17.9,16.3 18.1,16.1 v18.1,15.3
  Bottom 0.178: v63.5,41 64.85,41 65.3,40.55 71.4,40.55 v72.2,41.35 | v21.8,21.35 22.4,20.75 23.5,20.75 27.65,16.6 v27.65,6.8 | v22.4,26.15 22.95,26.7 22.95,36.85 v22.7,37.1 | v18.1,15.3 18.1,14.8 20.15,12.75 v20.15,3.85
D_A12  (via drill 0.3, 0.33)
  Top 0.178: IC11.45 67.85,39.25 67.05,38.45 67.05,34.6 67.75,33.9 67.75,29.55 65.1,26.9 65.1,26.65 64.65,26.2 64.1,26.2 v63.85,25.95 | v27.9,29.45 28.15,29.2 33.95,29.2 34.3,29.55 35.9,29.55 36.75,28.7 52.88,28.7 56.48,25.1 IC9.31 | v31.5,7.3 IC21.2 31.5,3.3 29.35,1.15 v20,1.15 | IC20.25 17.4,15.95 v17.5,15.85
  Bottom 0.178: v63.85,25.95 63.55,25.65 60.05,25.65 58.9,26.8 56.55,26.8 56.15,26.4 56.15,25.4 IC9.31 | v27.9,29.45 27.2,28.75 27.2,20.05 30.35,16.9 30.35,10 31.5,8.85 v31.5,7.3 | v17.5,15.85 17.5,14.9 19.8,12.6 19.8,4.35 19.55,4.1 19.55,3.3 20.2,2.65 20.2,1.35 v20,1.15
D_A13  (via drill 0.3, 0.33)
  Top 0.178: IC11.46 67.35,39.25 66.7,38.6 66.7,34.45 67.4,33.75 67.4,33 v67.15,32.75 | IC9.30 54.7,25.1 51.8,28 36.45,28 35.95,28.5 35.6,28.85 34.6,28.85 34.25,28.5 27.5,28.5 27,29 26.25,29 25.65,28.4 v24.75,28.4 | v29.3,7.35 IC21.26 29.3,3.3 27.85,1.85 20.65,1.85 20.2,2.3 v19.6,2.3 | v24.75,21.35 25.35,21.95 25.35,25.55 v24.75,26.15 | IC20.26 v16.9,15.3
  Bottom 0.178: IC9.30 54.7,25.5 56.4,27.2 59.05,27.2 60.25,26 63.05,26 63.8,26.75 63.8,31.55 64.8,32.55 66.95,32.55 v67.15,32.75 | v24.75,21.35 24.75,21 29.3,16.45 v29.3,7.35 | v24.75,26.15 v24.75,28.4 | v16.9,15.3 16.9,15 19.45,12.45 19.45,4.5 19.2,4.25 19.2,3.15 19.6,2.75 v19.6,2.3
D_A14  (via drill 0.3, 0.33)
  Top 0.178: v66.8,33.5 66.35,33.95 66.35,38.75 66.85,39.25 IC11.47 | IC9.29 52.93,25.1 52.9,25.1 50.7,27.3 36.15,27.3 35.3,28.15 34.9,28.15 34.55,27.8 26.85,27.8 v26.6,28.05 | v30.95,6.75 30.95,5.25 31.05,5.15 31.05,4.65 30.95,4.55 IC21.1 30.95,3.3 29.15,1.5 20.5,1.5 20.25,1.75 19.8,1.75 19.65,1.6 v19,1.6 | v26.6,21.35 27.2,21.95 27.2,25.55 v26.6,26.15 | IC20.27 16.4,16.35 v16.3,16.25
  Bottom 0.178: v66.8,33.5 66.8,33.35 66.35,32.9 64.65,32.9 63.45,31.7 63.45,26.9 62.9,26.35 60.45,26.35 59.2,27.6 55.45,27.6 IC9.29 | v26.6,21.35 26.6,20.15 30,16.75 30,9.85 30.95,8.9 v30.95,6.75 | v26.6,26.15 v26.6,28.05 | v16.3,16.25 16.3,15.1 19.1,12.3 19.1,4.65 18.85,4.4 18.85,3 19,2.85 v19,1.6
D_A15  (via drill 0.33)
  Top 0.178: IC11.48 66.35,39.25 66,38.9 v66,33.5 | IC9.28 51.15,25.15 49.7,26.6 35.25,26.6 34.4,27.45 18.55,27.45 16.5,25.4 16.5,19.3 15.9,18.7 IC20.28
  Bottom 0.178: IC9.28 54.07,28 59.35,28 60.65,26.7 62.75,26.7 63.1,27.05 63.1,31.85 64.6,33.35 65.85,33.35 v66,33.5
D_ADR  (via drill 0.33)
  Top 0.178: U1.9 IC9.9 | v18.35,28.4 23.95,28.4 24.55,29 25.75,29 26.1,29.35 27.15,29.35 27.65,28.85 34.1,28.85 34.45,29.2 35.75,29.2 36.1,28.85 36.6,28.35 52.7,28.35 55.6,25.45 55.6,24.75 57.4,22.95 57.4,22.1 57.9,21.6 58.95,21.6 v59.7,22.35 | IC11.90 72.35,26.1 v72.05,26.4
  Bottom 0.178: IC9.9 17.36,25.66 18.35,26.65 v18.35,28.4 | v59.7,22.35 60.55,23.2 65.6,23.2 66.8,24.4 70.05,24.4 v72.05,26.4
D_AL0  (via drill 0.3, 0.33)
  Top 0.178: IC11.64 60.9,32.15 57.9,35.15 46.1,35.15 45.05,34.1 41.55,34.1 40.85,33.4 38.05,33.4 37.45,34 v34.5,34 | v33.15,15.9 IC21.10
  Bottom 0.178: v33.15,15.9 33.15,19.85 32.15,20.85 32.15,21.35 32.5,21.7 32.5,32 v34.5,34
D_AL1  (via drill 0.3, 0.33)
  Top 0.178: IC11.63 60.9,32.65 58.05,35.5 45.95,35.5 44.9,34.45 41.4,34.45 40.7,33.75 39.15,33.75 v38.9,34 | v33.7,15.35 IC21.9
  Bottom 0.178: v38.9,34 38.9,30.05 34.25,25.4 34.25,22.1 34.9,21.45 34.9,20.75 33.7,19.55 v33.7,15.35
D_AL2  (via drill 0.3, 0.33)
  Top 0.178: v68.35,38.9 IC11.44 | v40.9,38.25 41.75,38.25 43.2,39.7 60.3,39.7 60.55,39.95 v62.25,39.95 | v34.8,16.9 IC21.8
  Bottom 0.178: v68.35,38.9 67.9,39.35 62.85,39.35 v62.25,39.95 | v34.8,16.9 34.8,19.45 36.1,20.75 36.1,21.45 36.05,21.5 36.05,25.4 39.5,28.85 39.5,36.85 v40.9,38.25
D_AL3  (via drill 0.33)
  Top 0.178: v69.35,38.9 IC11.42 | v60.8,39.35 43.35,39.35 41.65,37.65 39.8,37.65 v39.55,37.9 | IC21.7 34.25,15.1 v34.5,15.35 | v33.9,26.15 34.25,25.8 34.25,21.85 33.7,21.3 33.7,20.8 34.05,20.45 34.85,20.45 v35.5,21.1
  Bottom 0.178: v69.35,38.9 68.5,39.75 63.3,39.75 62.5,40.55 62,40.55 v60.8,39.35 | v39.55,37.9 38.3,36.65 38.3,29.95 34.5,26.15 v33.9,26.15 | v35.5,21.1 35.5,20.75 34.05,19.3 34.05,15.8 v34.5,15.35
D_AL4  (via drill 0.3, 0.33)
  Top 0.178: IC11.79 66.85,24.25 65.95,23.35 63.3,23.35 55.85,30.8 37.65,30.8 36.8,31.65 32,31.65 v31.9,31.55 | IC21.6 v33.7,7.3
  Bottom 0.178: 33.7,7.7 v33.7,7.3 33.7,9.5 32.6,10.6 32.6,16.65 30.7,18.55 30.7,30.35 v31.9,31.55
D_AL5  (via drill 0.3, 0.33)
  Top 0.178: IC11.80 67.35,24.25 66.1,23 63.15,23 55.7,30.45 37.5,30.45 37,30.95 36.65,31.3 33.55,31.3 33.2,30.95 30.35,30.95 v30.1,31.2 | IC21.5 v33.15,6.75 | v29.65,21.35 30,21.35 30.7,22.05 30.7,25.55 v30.1,26.15
  Bottom 0.178: v29.65,21.35 29.65,19.1 32.25,16.5 32.25,10.45 33.15,9.55 v33.15,6.75 | v30.1,26.15 v30.1,31.2
D_AL6  (via drill 0.3, 0.33)
  Top 0.178: IC11.57 62.2,35.65 62.05,35.8 60.75,35.8 58.95,37.6 44.1,37.6 42.4,35.9 40.2,35.9 39.6,35.3 29.75,35.3 v29.3,34.85 | IC21.4 v32.6,7.3
  Bottom 0.178: v29.3,34.85 28.95,34.5 28.95,19.3 31.9,16.35 31.9,10.3 32.6,9.6 v32.6,7.3
D_AL7  (via drill 0.3, 0.33)
  Top 0.178: IC11.56 60.9,36.15 59.1,37.95 43.95,37.95 42.25,36.25 40.05,36.25 39.45,35.65 29.15,35.65 v28.35,34.85 | IC21.3 v32.05,6.75 | v28.35,21.35 28.95,21.95 28.95,25.55 v28.35,26.15
  Bottom 0.178: v28.35,21.35 28.35,19.4 31.55,16.2 31.55,10.15 32.05,9.65 v32.05,6.75 | v28.35,26.15 28.35,29.05 28.5,29.2 28.5,29.7 28.35,29.85 v28.35,34.85
D_ASR0
  Top 0.178: U1.2 IC9.2
D_ASR1
  Top 0.178: U1.1 IC9.1
D_ASR2  (via drill 0.33)
  Top 0.178: IC9.63 U1.63 4.95,41.48 4.95,31 1.2,27.25 1.2,21.3 2.95,19.55 v6.05,19.55 | v8.7,19.8 R2.4
  Bottom 0.178: v8.7,19.8 6.3,19.8 v6.05,19.55
D_ASR3
  Top 0.178: U1.62 IC9.62
D_CCLK  (via drill 0.33)
  Top 0.178: U1.8 IC9.8 15.59,25.19 18.2,27.8 25.55,27.8 26.4,28.65 26.8,28.65 27.3,28.15 34.4,28.15 34.75,28.5 35.45,28.5 35.8,28.15 36.3,27.65 51.6,27.65 53.8,25.45 53.8,24.75 54.1,24.45 54.1,23.9 53.8,23.6 v53.8,21.85 | IC11.87 70.85,26.05 v71.2,26.4
  Bottom 0.178: v53.8,21.85 54.05,21.6 58.65,21.6 59.1,22.05 59.1,22.75 59.55,23.2 60.05,23.2 60.4,23.55 65.45,23.55 66.65,24.75 69.55,24.75 v71.2,26.4
D_DA0  (via drill 0.33)
  Top 0.178: IC9.27 49.37,24.37 48.45,23.45 48.45,22 46.3,19.85 38.6,19.85 36.4,17.65 32.75,17.65 32.6,17.5 IC21.11 32.6,13.65 26.55,7.6 26.55,5.75 24.9,4.1 21.25,4.1 19.9,5.45 IC20.61 | IC11.75 61.5,26.65 56.3,31.85 49.65,31.85 v49.4,32.1 | IC11.75 63.95,26.65 64,26.7 63.9,26.7 IC11.75
  Bottom 0.178: 49.35,25.09 IC9.27 49.4,25.11 v49.4,32.1
D_DA1  (via drill 0.33)
  Top 0.178: IC9.26 47.59,24.34 46.7,23.45 46.7,22 44.9,20.2 38.45,20.2 36.25,18 32.55,18 32.05,17.5 IC21.12 32.05,13.6 26.2,7.75 26.2,5.9 24.75,4.45 21.4,4.45 20.4,5.45 IC20.62 | IC11.76 65.35,24.25 65.15,24.05 63.6,24.05 56.15,31.5 48.3,31.5 v48.05,31.75
  Bottom 0.178: IC9.26 48.05,25.55 v48.05,31.75
D_DA2  (via drill 0.33)
  Top 0.178: IC9.25 45.81,25.06 44.95,24.2 44.95,22 43.5,20.55 38.3,20.55 36.1,18.35 32.35,18.35 31.5,17.5 IC21.13 31.5,16.1 31.6,16 31.6,13.65 25.85,7.9 25.85,6.05 24.6,4.8 21.55,4.8 20.9,5.45 IC20.63 | IC11.77 65.85,24.25 65.3,23.7 63.45,23.7 56,31.15 46.95,31.15 v46.7,31.4
  Bottom 0.178: IC9.25 46.7,25.96 v46.7,31.4
D_DA3  (via drill 0.33)
  Top 0.178: IC9.24 44.04,25.03 43.15,24.15 43.15,22 42.05,20.9 38.15,20.9 35.95,18.7 31.6,18.7 30.4,17.5 IC21.15 30.4,16.1 30.3,16 30.3,12.85 25.5,8.05 25.5,6.2 24.45,5.15 21.7,5.15 21.4,5.45 IC20.64 | IC11.60 62.7,34.15 61.85,35 60.55,35 58.65,36.9 45,36.9 v44.4,36.3
  Bottom 0.178: IC9.24 44.4,25.44 v44.4,36.3
D_DA4  (via drill 0.33)
  Top 0.178: IC9.23 42.26,25.06 41.35,24.15 41.35,22 40.6,21.25 38,21.25 35.8,19.05 31.4,19.05 29.85,17.5 IC21.16 29.85,15.5 24.65,10.3 IC20.5 | IC11.72 60.5,28.15 55.95,32.7 47.15,32.7 45.85,31.4 v43.45,31.4
  Bottom 0.178: IC9.23 43.45,26.27 v43.45,31.4
D_DA5  (via drill 0.33)
  Top 0.178: IC9.22 39.6,24.2 39.6,22 39.2,21.6 37.85,21.6 35.65,19.4 31.2,19.4 29.3,17.5 IC21.17 29.3,15.45 24.65,10.8 IC20.6 | IC11.71 60.5,28.65 56.1,33.05 47,33.05 45.95,32 42.75,32 v42.15,31.4
  Bottom 0.178: IC9.22 42.15,26.75 v42.15,31.4
D_DA6  (via drill 0.33)
  Top 0.178: IC9.21 38.7,25.05 37.8,24.15 37.8,22.05 35.5,19.75 31,19.75 28.75,17.5 IC21.18 28.75,15.4 25.55,12.2 24.75,12.2 24.65,12.3 IC20.9 | IC11.61 62.75,33.65 62.2,33.1 60.95,33.1 58.2,35.85 45.8,35.85 44.75,34.8 40.9,34.8 v40.45,34.35
  Bottom 0.178: IC9.21 40.45,26.83 v40.45,34.35
D_DA7  (via drill 0.33)
  Top 0.178: IC9.20 36.05,24.2 36.05,21.5 36.1,21.45 36.1,20.85 35.35,20.1 30.8,20.1 28.2,17.5 IC21.19 28.2,15.35 25.4,12.55 25,12.55 24.75,12.8 IC20.10 | IC11.58 62.2,35.15 61.95,35.4 60.65,35.4 58.8,37.25 44.55,37.25 v43.45,36.15
  Bottom 0.178: IC9.20 36.9,25.1 39.85,28.05 39.85,34.55 41.45,36.15 v43.45,36.15
D_DOUT0
  Top 0.178: U1.61 IC9.61
D_DOUT1
  Top 0.178: U1.60 IC9.60
D_DOUT2
  Top 0.178: U1.59 IC9.59
D_DOUT3
  Top 0.178: U1.58 IC9.58
D_DOUT4
  Top 0.178: U1.57 IC9.57
D_DOUT5
  Top 0.178: U1.56 IC9.56
D_DOUT6
  Top 0.178: U1.55 IC9.55
D_DOUT7
  Top 0.178: U1.54 IC9.54
D_PA0  (via drill 0.33)
  Top 0.178: IC4.4 v77.6,44.05
  Bottom 0.178: v77.6,44.05 76.4,42.85 61.8,42.85 58.9,39.95 54.45,39.95 U1.36
D_PA1  (via drill 0.33)
  Top 0.178: IC3.4 74.8,44.45 75.1,44.15 v75.55,44.15
  Bottom 0.178: v75.55,44.15 74.6,43.2 61.65,43.2 58.75,40.3 55.88,40.3 U1.35
D_PA2  (via drill 0.33)
  Top 0.178: IC2.4 72,44.45 72.3,44.15 v72.8,44.15
  Bottom 0.178: v72.8,44.15 72.2,43.55 64.6,43.55 64.05,43.55 61.5,43.55 58.6,40.65 57.31,40.65 U1.34
D_PA3  (via drill 0.33)
  Top 0.178: IC1.4 v70,44.15
  Bottom 0.178: U1.33 58.93,41.48 61.35,43.9 69.75,43.9 v70,44.15
D_PA4
  Top 0.178: U1.31 56.53,22.42 59.95,19 69.3,19 69.45,19.15 IC16.4
D_PA5
  Top 0.178: U1.30 54.73,22.42 58.5,18.65 71.75,18.65 72.25,19.15 IC17.4
D_PA6
  Top 0.178: IC18.4 75.05,19.15 74.2,18.3 56.4,18.3 52.93,21.77 U1.29
D_PA7
  Top 0.178: U1.28 55.62,17.95 76.6,17.95 77.85,19.2 IC19.4
D_PB0  (via drill 0.33)
  Top 0.178: IC5.4 v80.4,44.1
  Bottom 0.178: U1.27 49.38,22.42 49.38,22.38 51.15,20.6 65.4,20.6 66.5,21.7 80.6,21.7 81.2,22.3 81.2,23.9 81.9,24.6 81.9,42.6 v80.4,44.1
D_PB1  (via drill 0.33)
  Top 0.178: v84.6,40.85 IC6.4
  Bottom 0.178: U1.26 47.59,22.21 49.55,20.25 65.55,20.25 66.65,21.35 80.75,21.35 81.55,22.15 81.55,23.75 82.25,24.45 82.25,38.5 v84.6,40.85
D_PB2  (via drill 0.33)
  Top 0.178: IC7.4 84.3,38.05 84.6,37.75 v84.6,37.55
  Bottom 0.178: U1.25 48.34,19.9 65.7,19.9 66.8,21 80.9,21 81.9,22 81.9,23.6 82.6,24.3 82.6,35.55 v84.6,37.55
D_PB3  (via drill 0.33)
  Top 0.178: IC8.4 v84.6,35.25
  Bottom 0.178: U1.24 46.91,19.55 65.85,19.55 66.95,20.65 81.05,20.65 82.25,21.85 82.25,23.45 82.95,24.15 82.95,33.6 v84.6,35.25
D_PB4  (via drill 0.33)
  Top 0.178: IC10.4 v84.6,32.45
  Bottom 0.178: U1.23 45.48,19.2 66,19.2 67.1,20.3 81.2,20.3 82.6,21.7 82.6,23.3 83.3,24 83.3,31.15 v84.6,32.45
D_PB5  (via drill 0.33)
  Top 0.178: IC12.4 v84.6,29.65
  Bottom 0.178: U1.22 44.1,18.8 80.2,18.8 82.95,21.55 82.95,23.15 83.65,23.85 83.65,28.7 v84.6,29.65
D_PB6  (via drill 0.33)
  Top 0.178: IC13.4 v84.6,26.85
  Bottom 0.178: U1.21 42.68,18.45 80.35,18.45 83.3,21.4 83.3,23 84,23.7 84,26.25 v84.6,26.85
D_PB7  (via drill 0.33)
  Top 0.178: v84.65,24.05 IC14.4
  Bottom 0.178: U1.20 41.25,18.1 80.5,18.1 83.65,21.25 83.65,22.85 84.65,23.85 v84.65,24.05
D_PC0
  Top 0.178: U1.48 IC9.48
D_PC1
  Top 0.178: U1.47 IC9.47
D_PC2
  Top 0.178: U1.46 IC9.46
D_PC3/SDAT0  (via drill 0.3, 0.33)
  Top 0.178: IC9.45 U1.45 35.95,40.5 v16.8,40.5 | R2.1 v11.1,20.1
  Bottom 0.178: v11.1,20.1 10.1,21.1 8.45,21.1 7.6,21.95 7.6,25.45 6.2,26.85 6.2,29.9 15.8,39.5 16.1,39.5 16.8,40.2 v16.8,40.5
D_PC4/SCLK  (via drill 0.3, 0.33)
  Top 0.178: IC9.44 U1.44 37.38,40.15 17.3,40.15 17.05,39.9 16.1,39.9 v15.9,40.1 | R2.2 v10.3,20.1
  Bottom 0.178: v10.3,20.1 9.65,20.75 7.05,20.75 5.85,21.95 5.85,30.05 v15.9,40.1
D_PC5/SDAT1  (via drill 0.3, 0.33)
  Top 0.178: IC9.43 U1.43 39.75,40.75 | 39.75,40.75 | 39.75,40.75 38.8,39.8 17.5,39.8 17.2,39.5 14.85,39.5 v14.65,39.7 | R2.3 v9.5,20.1
  Bottom 0.178: v9.5,20.1 9.2,20.4 5.6,20.4 4.05,21.95 4.05,25.45 5.5,26.9 5.5,30.2 14.65,39.35 v14.65,39.7
D_PC6
  Top 0.178: U1.42 IC9.42
D_PC7
  Top 0.178: U1.41 IC9.41
D_PD0
  Top 0.178: U1.40 IC9.40
D_PD1
  Top 0.178: U1.39 IC9.39
D_PD2
  Top 0.178: U1.38 IC9.38
D_PD3
  Top 0.178: U1.37 IC9.37
D_SCLK
  Top 0.178: IC9.13 U1.13 24.5,22.42 24,21.92 24,21.25 25.2,20.05 R3.2
  Bottom 0.178: U1.13
D_SCLKA
  Top 0.178: IC20.14 24.65,14.8 25.2,15.35 R3.7
D_SCLKB  (via drill 0.3)
  Top 0.178: R2.7 10.3,15 11,14.3 IC20.36 19.3,14.3 20.1,15.1 v21,15.1 | IC20.18 v20.9,16.6
  Bottom 0.178: v20.9,16.6 21,16.5 v21,15.1
D_SCLKB1
  Top 0.178: R2.8 11.1,16.45 10.7,16.05 10.7,15.1 11,14.8 IC20.35 12.85,14.8 13,14.65 19.15,14.65 19.95,15.45 20.55,15.45 21.45,16.35 21.45,16.8 21.4,16.85 IC20.17
D_SDATA0
  Top 0.178: IC20.15 24.65,15.3 24.85,15.5 24.85,15.9 24.4,16.35 R3.6
D_SDATA1
  Top 0.178: IC20.13 24.65,14.3 25.55,15.2 25.55,15.9 26,16.35 R3.8
D_SDATB1  (via drill 0.3)
  Top 0.178: R2.6 9.5,16.45 9.9,16.05 9.9,14.9 11,13.8 IC20.37 12.85,13.8 13,13.95 19.75,13.95 v20.35,14.55 | IC20.19 20.4,16.85 20.35,16.8 v20.35,16.05
  Bottom 0.178: v20.35,16.05 v20.35,14.55
D_SIN0
  Top 0.178: U1.17 IC9.17 | U1.17 | R3.1 27.85,18.7 31.57,22.42 U1.17
D_SIN1
  Top 0.178: U1.16 IC9.16
D_SIN2
  Top 0.178: U1.15 IC9.15
D_SIN3
  Top 0.178: U1.14 IC9.14
D_SOUT0  (via drill 0.33)
  Top 0.178: v34.3,21.1 35.15,21.95 U1.19 | R3.3 24.4,18.05 24.55,17.9 27.55,17.9 30.75,21.1 v32.75,21.1
  Bottom 0.178: U1.19 IC9.19 | v32.75,21.1 v34.3,21.1
D_SOUT1
  Top 0.178: U1.18 IC9.18
GND  (via drill 0.3, 0.33, 0.38)
  Top 0.254: IC14.2 v81.15,24.7 | IC13.2 81.2,27.5 v81.15,27.45 | IC12.2 81.2,30.3 v81.15,30.25 | IC10.2 81.2,33.1 v81.15,33.05 | IC8.2 81.2,35.9 v81.15,35.85 | IC7.2 81.2,38.7 v81.15,38.65 | IC11.95 v74.85,26.4 | IC16.2 v70.1,22.3 | IC17.2 v72.9,22.3 | IC18.2 v75.7,22.3 | IC19.2 v78.5,22.3 | JP1.GND v85.95,27.3 | IC11.11 v77.65,31.65 | IC11.86 v70.35,26.4 | IC11.74 62.65,27.15 v62.5,27.3 | IC11.59 v65.05,34.65 | IC11.43 v68.85,41.35 | IC11.38 v71.35,41.35 | IC11.26 v77.9,40.15 | IC1.2 68.55,42.3 v68.6,42.25 | IC2.2 71.35,42.3 v71.4,42.25 | IC4.2 76.95,42.3 v77,42.25 | IC5.2 79.75,42.3 v79.8,42.25 | IC3.2 74.15,42.3 v74.2,42.25 | IC6.2 81.2,41.5 v81.15,41.45 | C1.1 v82.9,45 | C2.1 v83.75,45 | IC21.14 v30.95,15.75
  Top 0.305: IC20.54 16.4,7.25 16.1,7.55 v15.2,7.55 | IC20.7 22.5,11.3 22.15,10.95 v22.15,10.3 | IC20.47 12.8,8.8 13.15,9.15 v13.15,10 | IC20.22 18.9,18.8 v18.4,19.3 | IC20.33 12.8,15.8 13.15,16.15 v13.15,17 | X1.3 X1.5 2.55,14.45 v3.2,13.8 | X1.9 2.54,11.91 v3.2,11.25
  Top 0.406: C4.2 84.5,19 84.15,19.35 v83.75,19.35 IC15.2 83.75,20.8 83.55,21 C3.2
  Bottom 0.178: C52.1 23.3,2.9 v23.9,3.5 24.5,2.9 C51.1
  Bottom 0.254: C60.1 67.65,19.55 v67.6,19.6 | C61.1 72.65,22.55 v72.9,22.3 | v65.05,34.65 C75.1 C74.1 v67.95,35.9 69.45,35.9 C78.1 C77.1 v72.1,36.1 C76.1 v74.85,36.1 C73.1 C72.1 | C63.1 C62.1 v73.85,29.15 | C64.1 C65.1 v68.35,30.2 66.75,30.2 C71.1 C68.1 | C67.1 C66.1 v77.6,29.35 | C79.1 v76.55,38.8 | C58.2 v13.15,17
  Bottom 0.305: C70.1 v9.85,28.75 | C69.2 v15.9,28.75 | v18.4,10.15 C56.2 v17.4,11.2 | C57.2 22.35,10.1 v22.15,10.3 | C55.2 v13.15,10 | C54.2 v15.2,7.55 | C50.2 v17.9,2.35 | C59.2 v18.4,19.3 | C53.1 v27.65,5.75 | v3.1,37.2 C80.1 C81.1 v1.7,37.2
  pour GND: -0.75,47.3 87.45,47.3 87.45,-3 -0.75,-3
IO_1
  Top 0.178: IC11.70 60.5,29.15 56.25,33.4 46.85,33.4 45.8,32.35 42.3,32.35 41.6,31.65 37.3,31.65 36.95,32 33.65,32 33.5,32.15 26.25,32.15 24.85,30.75 8.7,30.75 8.3,30.35 8.3,27.05 9.4,25.95 10.65,25.95 11.15,25.45 11.15,22 12.9,20.25 14.05,20.25 15.4,18.9 IC20.29
IO_2
  Top 0.178: IC11.69 60.5,29.65 56.4,33.75 46.7,33.75 45.65,32.7 42.15,32.7 41.45,32 37.45,32 37.1,32.35 33.8,32.35 33.65,32.5 26.1,32.5 24.7,31.1 8.55,31.1 7.95,30.5 7.95,26.9 9.35,25.5 9.35,21.95 10.15,21.15 11.5,21.15 12.75,19.9 13.9,19.9 14.9,18.9 IC20.30
IO_3
  Top 0.178: IC11.68 60.5,30.15 56.55,34.1 46.55,34.1 45.5,33.05 42,33.05 41.3,32.35 37.6,32.35 37.25,32.7 33.95,32.7 33.8,32.85 25.95,32.85 24.55,31.45 8.4,31.45 7.6,30.65 7.6,21.95 8.75,20.8 11.35,20.8 12.6,19.55 13.75,19.55 14.4,18.9 IC20.31
IO_4
  Top 0.178: IC11.67 60.5,30.65 56.7,34.45 46.4,34.45 45.35,33.4 41.85,33.4 41.15,32.7 37.75,32.7 37.4,33.05 34.1,33.05 33.95,33.2 25.8,33.2 24.4,31.8 8.25,31.8 7.25,30.8 7.25,26.9 5.85,25.5 5.85,21.95 6.25,21.55 7,21.55 8.1,20.45 8.1,16.2 11,13.3 IC20.38
N$1  (via drill 0.3)
  Top 0.254: IC20.56 v17.4,7.4
  Bottom 0.254: v17.4,7.4 C56.1
N$2  (via drill 0.3)
  Top 0.254: IC20.55 v16.9,5.05
  Bottom 0.254: C54.1 v16.9,5.05 C50.1
N$3  (via drill 0.33)
  other vias: 85.95,28.3
N$4  (via drill 0.33)
  Top 0.178: IC20.42 12.8,11.3 13.2,11.7 v13.2,12.85 | R2.5 8.7,16.4 v9.15,15.95
  Bottom 0.178: v9.15,15.95 12.25,12.85 v13.2,12.85
N$14
  Top 0.305: IC20.20 19.9,19.05 18.05,20.9 C5.2
N$17
  Top 0.178: IC20.51 14.9,5.25 15.15,5 TP6.TP
N$18
  Top 0.178: IC20.53 15.9,5.25 16.45,4.7 TP7.TP
SERCOM3_0_TX
  Top 0.178: R4.2 6.85,10.55 7.35,11.05 7.8,11.05 8.05,10.8 IC20.43
SERCOM3_1_CLK  (via drill 0.33)
  Top 0.178: IC20.44 10.95,10.3 10.8,10.45 v7.55,10.45 | v6.25,10.45 6.05,10.25 R4.3
  Bottom 0.178: v7.55,10.45 v6.25,10.45
SERCOM3_2_RX
  Top 0.178: IC20.45 10.95,9.8 10.65,10.1 8.05,10.1 7.65,9.7 R4.1
SWCLK  (via drill 0.33)
  Top 0.178: IC20.57 17.9,4.3 15,1.4 1.65,1.4 0.7,2.35 0.7,7 v3.7,10 | X1.4 5.11,15.24 5.25,15.1 6.2,15.1 v6.65,14.65
  Bottom 0.178: v3.7,10 4,10 5.45,11.45 5.45,13.45 v6.65,14.65
SWDIO  (via drill 0.33)
  Top 0.178: IC20.58 18.4,4.3 15.15,1.05 1.5,1.05 0.35,2.2 0.35,7.15 3.1,9.9 3.1,10.2 3.65,10.75 v3.95,10.75 | X1.2 v5.1,17.9
  Bottom 0.178: v5.1,17.9 5.1,11.9 v3.95,10.75
TCK  (via drill 0.33)
  Top 0.178: IC11.62 64.8,33.15 v66,31.95 | JP1.TCK v85.95,30.8 85.95,30.05 84.95,29.05 82.6,29.05 82.45,29.2 80.5,29.2 v80.4,29.3 | IC20.49 13.9,5.4 TP4.TP
  Bottom 0.178: v80.4,29.3 78.85,29.3 76.8,31.35 66.6,31.35 v66,31.95 | v85.95,30.8 86.65,31.5 86.65,44.45 84.8,46.3 11.2,46.3 9.4,44.5 9.4,37.2 1.2,29 1.2,9.75 4.55,6.4 11.7,6.4 TP4.TP
  other vias: 13.3,4.8
TDI  (via drill 0.33)
  Top 0.178: IC11.4 78,28.15 77.9,28.25 77.3,28.25 72.55,33 72.55,34 73.55,35 76.1,35 77.45,36.35 v77.6,36.35 | v80.35,35.85 80.55,36.05 80.55,36.85 80.95,37.25 84.05,37.25 84.35,36.95 85.7,36.95 85.95,36.7 JP1.TDI | TP3.TP 24.7,9.3 IC20.3 22.55,9.3 21.9,8.65 v15.8,8.65
  Top 0.406: JP1.TDI v85.95,35.9
  Bottom 0.178: v80.35,35.85 79.85,36.35 v77.6,36.35 | v85.95,35.9 85.95,37.55 85.35,38.15 85.35,38.75 85.6,39 85.6,44.5 84.5,45.6 14,45.6 12.9,44.5 12.9,39.7 1.9,28.7 1.9,10.05 4.85,7.1 13.55,7.1 15.1,8.65 v15.8,8.65
TDO  (via drill 0.33)
  Top 0.178: IC11.73 65.35,27.65 67.15,29.45 v67.15,31.95 | v80.35,33.05 80.35,33.85 80.95,34.45 85.65,34.45 85.95,34.15 JP1.TDO | TP2.TP 25.1,9.8 IC20.4 22.55,9.8 21.75,9 16.6,9 v16.35,9.25 | v82.9,44.15 81.4,44.15 81.05,44.5 81.05,45.45 80.45,46.05 16.25,46.05 14.7,44.5 14.7,41 v13.75,40.05
  Top 0.406: v85.95,33.35 JP1.TDO
  Bottom 0.178: v80.35,33.05 78.15,33.05 77.05,31.95 v67.15,31.95 | v85.95,33.35 85.95,35.1 85.35,35.7 85.35,37.65 85,38 85,38.9 85.25,39.15 85.25,42.8 83.9,44.15 v82.9,44.15 | v13.75,40.05 2.25,28.55 2.25,10.2 5,7.45 13.4,7.45 15.2,9.25 v16.35,9.25
TMS  (via drill 0.33)
  Top 0.178: v80.45,39.05 80.45,39.55 80.95,40.05 R1.1 JP1.TMS | IC11.15 78,33.65 v77.6,34.05 | IC20.50 TP5.TP
  Bottom 0.178: v80.45,39.05 80.45,38.35 79.75,37.65 78.1,37.65 77,36.55 77,36.15 77.4,35.75 77.85,35.75 78.2,35.4 78.2,34.65 v77.6,34.05 | JP1.TMS 85.95,44.65 84.65,45.95 12.6,45.95 11.15,44.5 11.15,38.45 1.55,28.85 1.55,9.9 4.7,6.75 12.45,6.75 TP5.TP
  other vias: 85.95,38.45 14.4,4.8
VCC  (via drill 0.3, 0.33, 0.38)
  Top 0.254: IC16.6 v71.35,19.65 | IC17.6 v74.15,19.65 | IC18.6 v76.95,19.65 | IC19.6 v79.75,19.65 | IC8.6 84.4,36.55 v84.6,36.35 | IC7.6 v84.6,39.35 | IC10.6 v84.6,33.75 | IC12.6 v84.65,30.95 | IC13.6 v84.65,28.15 | IC14.6 v84.65,25.35 | IC1.6 v67,44.95 | IC2.6 v70.05,44.95 | IC3.6 v72.85,44.95 | IC4.6 v75.65,44.95 | IC5.6 v78.45,44.95 | IC6.6 v84.6,42.15 84.65,42.15 C2.2 | IC20.48 v13.15,8.3 | IC20.34 v13.15,15.3 | v19.4,16.55 IC20.21 | IC20.8 v22.15,11.8
  Top 0.305: IC21.28 v30.4,4.8 | TP1.TP v85.9,22.05 | X1.1 2.49,16.99 v3.2,17.7
  Top 0.406: IC15.1 v82.8,19.35 C4.1 | IC15.3 v85.5,20.2
  Bottom 0.254: C60.2 71.25,19.55 v71.35,19.65 | v13.15,8.3 C55.1 | v13.15,15.3 C58.1 | C59.1 v19.4,16.55 | v22.15,11.8 C57.1
  Bottom 0.305: U1.64 3.14,39.99 C80.2 C81.2 | v30.4,4.8 C53.2
  other vias: 85.9,23.3
  pour Supply (rank 2): -3.7,49.5 -3.7,-7.85 91.2,-8.7 91.2,48.65
VCC_CPLD  (via drill 0.33, 0.38)
  Top 0.178: R1.2 85.95,43.55 85.35,44.15 83.8,44.15 82.95,43.3 C1.2
  Top 0.254: IC13.1 81.25,28.15 v81.15,28.25 | v81.15,25.5 81.3,25.35 IC14.1 82.6,25.35 83.3,26.05 84.8,26.05 85.1,25.75 JP1.VCC | IC12.1 81.25,30.95 v81.15,31.05 | IC10.1 81.25,33.75 v81.15,33.85 | IC8.1 81.25,36.55 v81.15,36.65 | IC7.1 81.25,39.35 v81.15,39.45 | IC11.91 v72.85,26.4 | IC11.3 v77.65,27.65 | IC16.1 70.75,22.15 v70.9,22.3 | IC17.1 73.55,22.15 v73.7,22.3 | IC18.1 76.35,22.15 v76.5,22.3 | IC19.1 79.15,22.15 v79.3,22.3 | IC11.82 v68.35,26.4 | IC11.18 v77.6,35.15 | IC11.51 v65.05,38.65 | IC11.39 v70.85,38.9 | IC11.66 v65.05,31.15 | IC3.1 73.5,42.35 v73.4,42.25 | IC2.1 70.7,42.35 v70.6,42.25 | IC1.1 67.9,42.35 v67.8,42.25 | IC4.1 76.3,42.35 v76.2,42.25 | IC5.1 79.1,42.35 v79,42.25 | v81.15,42.25 81.25,42.15 IC6.1 C1.2 | IC11.34 v73.35,38.9
  Top 0.406: IC15.5 C3.1 80.6,22.7 v80.3,23
  Bottom 0.254: v77.65,27.65 C66.2 C67.2 | v72.85,26.4 C62.2 C63.2 | v68.35,26.4 C65.2 C64.2 | v77.6,35.15 C73.2 C72.2 | v65.05,38.65 C75.2 C74.2 | v70.85,38.9 C77.2 C78.2 | v65.05,31.15 C71.2 C68.2 | v73.35,38.9 C76.2 C79.2 | C61.2 70.9,23.25 v70.9,22.3
  other vias: 85.95,25.75
  pour Supply: 62.2,44 62.2,21 82.45,21 82.45,44
X_ADR  (via drill 0.33)
  Top 0.178: IC11.53 60.9,37.65 59.55,39 43.5,39 41.8,37.3 39.6,37.3 39,36.7 23.1,36.7 19.25,32.85 7.8,32.85 1.9,26.95 1.9,21.6 3,20.5 6.55,20.5 7.05,20 7.05,15.75 10.4,12.4 v10.4,12.05 | IC20.59 18.9,7.2 18.05,8.05 15.55,8.05 13.75,9.85 13.75,10.3 v13.2,10.85
  Bottom 0.178: v13.2,10.85 12,12.05 v10.4,12.05
X_SCLK
  Top 0.178: R4.6 6.05,3.55 X2.3
X_SRX
  Top 0.178: R4.8 8,7.35 10.15,5.2 X2.5
X_STX
  Top 0.178: R4.7 6.85,5.75 8.15,4.45 X2.4
XIN32  (via drill 0.33)
  Top 0.178: IC20.1 23.4,7.15 v23.7,6.85
  Bottom 0.178: v23.7,6.85 23.3,6.45 X50.1 C52.2
XOUT32  (via drill 0.33)
  Top 0.178: IC20.2 24.25,8.8 24.45,8.6 24.45,6.45 v24.1,6.1
  Bottom 0.178: v24.1,6.1 24.45,6.45 X50.2 C51.2

## Text on the board
tPlace: ToyoTune 2.1 | Copyright 2020, Jon Sole
bPlace: TMS | TDI | TDO | TCK | GND | 3v3 | 5v0
DrillLegend: LAYER-STACK
DrillLegend_01-16: 01-16
DrillLegend_01-20: 01-20